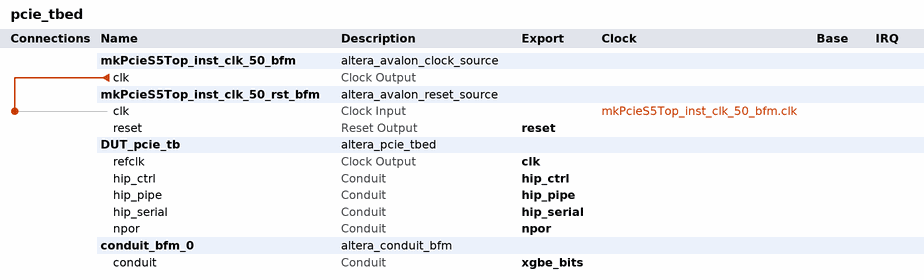
[diagram p0: system contents]
# Platform Designer (Qsys) system pcie_tbed, Stratix V Unknown
# Parameters at their usual value, and those the tool derives, are not listed.
package require -exact qsys 14.0
create_system pcie_tbed
set_project_property DEVICE_FAMILY {Stratix V}
set_project_property DEVICE Unknown

add_instance mkPcieS5Top_inst_clk_50_bfm altera_avalon_clock_source 14.0

add_instance mkPcieS5Top_inst_clk_50_rst_bfm altera_avalon_reset_source 14.0
set_instance_parameter_value mkPcieS5Top_inst_clk_50_rst_bfm ASSERT_HIGH_RESET 0
set_instance_parameter_value mkPcieS5Top_inst_clk_50_rst_bfm INITIAL_RESET_CYCLES 50

add_instance DUT_pcie_tb altera_pcie_tbed 14.0
set_instance_parameter_value DUT_pcie_tb use_stratixv_tb_device false
set_instance_parameter_value DUT_pcie_tb lane_mask_hwtcl x8
set_instance_parameter_value DUT_pcie_tb gen123_lane_rate_mode_hwtcl {Gen2 (5.0 Gbps)}
set_instance_parameter_value DUT_pcie_tb port_type_hwtcl {Native endpoint}
set_instance_parameter_value DUT_pcie_tb pll_refclk_freq_hwtcl {100 MHz}
set_instance_parameter_value DUT_pcie_tb apps_type_hwtcl 2
set_instance_parameter_value DUT_pcie_tb serial_sim_hwtcl 0
set_instance_parameter_value DUT_pcie_tb enable_pipe32_sim_hwtcl 0
set_instance_parameter_value DUT_pcie_tb enable_tl_only_sim_hwtcl 0
set_instance_parameter_value DUT_pcie_tb deemphasis_enable_hwtcl false
set_instance_parameter_value DUT_pcie_tb pld_clk_MHz 2500
set_instance_parameter_value DUT_pcie_tb millisecond_cycle_count_hwtcl 248500
set_instance_parameter_value DUT_pcie_tb use_crc_forwarding_hwtcl 0
set_instance_parameter_value DUT_pcie_tb ecrc_check_capable_hwtcl 0
set_instance_parameter_value DUT_pcie_tb ecrc_gen_capable_hwtcl 0
set_instance_parameter_value DUT_pcie_tb enable_pipe32_phyip_ser_driver_hwtcl 0

add_instance conduit_bfm_0 altera_conduit_bfm 14.0
set_instance_parameter_value conduit_bfm_0 CLOCKED_SIGNAL false
set_instance_parameter_value conduit_bfm_0 ENABLE_RESET false
set_instance_parameter_value conduit_bfm_0 SIGNAL_ROLES xgbe_rx_in,xgbe_txout
set_instance_parameter_value conduit_bfm_0 SIGNAL_WIDTHS 1,1
set_instance_parameter_value conduit_bfm_0 SIGNAL_DIRECTIONS input,output

# connections
add_connection mkPcieS5Top_inst_clk_50_bfm.clk mkPcieS5Top_inst_clk_50_rst_bfm.clk clock

# exported interfaces
add_interface xgbe_bits conduit end
set_interface_property xgbe_bits EXPORT_OF conduit_bfm_0.conduit
add_interface npor conduit end
set_interface_property npor EXPORT_OF DUT_pcie_tb.npor
add_interface clk clock source
set_interface_property clk EXPORT_OF DUT_pcie_tb.refclk
add_interface hip_pipe conduit end
set_interface_property hip_pipe EXPORT_OF DUT_pcie_tb.hip_pipe
add_interface hip_serial conduit end
set_interface_property hip_serial EXPORT_OF DUT_pcie_tb.hip_serial
add_interface hip_ctrl conduit end
set_interface_property hip_ctrl EXPORT_OF DUT_pcie_tb.hip_ctrl
add_interface reset reset source
set_interface_property reset EXPORT_OF mkPcieS5Top_inst_clk_50_rst_bfm.reset

set_interconnect_requirement {$system} qsys_mm.clockCrossingAdapter HANDSHAKE
set_interconnect_requirement {$system} qsys_mm.maxAdditionalLatency 1
set_interconnect_requirement {$system} qsys_mm.insertDefaultSlave FALSE

save_system pcie_tbed.qsys
